# Altium schematic sheet LineCliffSensors.SchDoc
size A
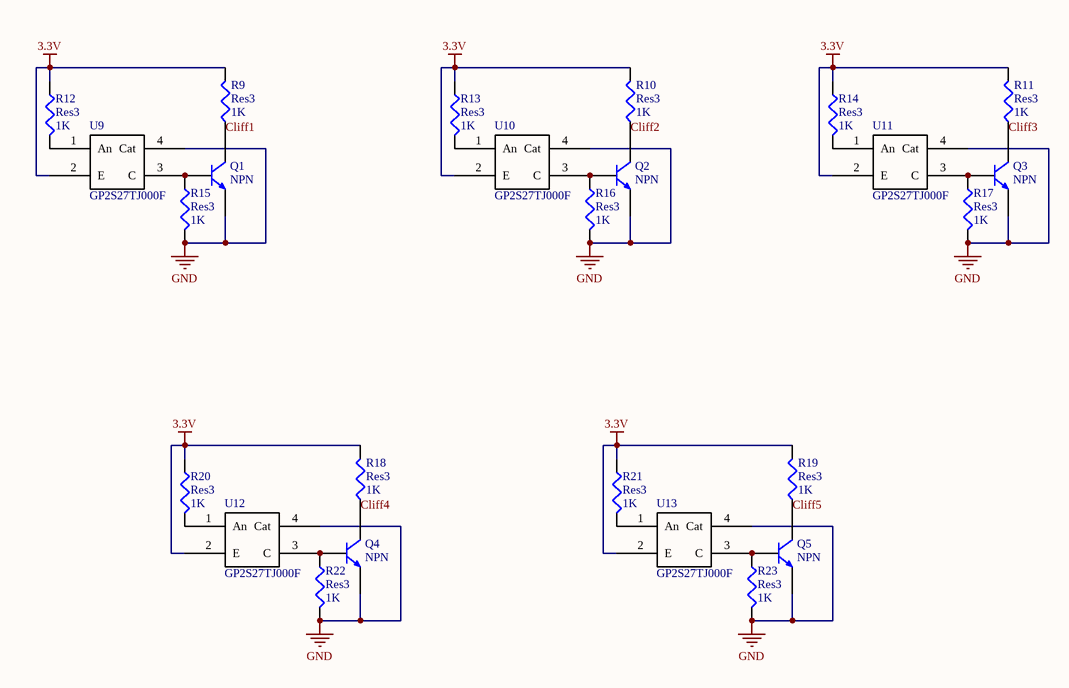
[diagram p0: LineCliffSensors.SchDoc]

## Parts
Q1  NPN  [SOT-23]
Q2  NPN  [SOT-23]
Q3  NPN  [SOT-23]
Q4  NPN  [SOT-23]
Q5  NPN  [SOT-23]
R9  Res3  value 1K  [RESC1608L]
R10  Res3  value 1K  [RESC1608L]
R11  Res3  value 1K  [RESC1608L]
R12  Res3  value 1K  [RESC1608L]
R13  Res3  value 1K  [RESC1608L]
R14  Res3  value 1K  [RESC1608L]
R15  Res3  value 1K  [RESC1608L]
R16  Res3  value 1K  [RESC1608L]
R17  Res3  value 1K  [RESC1608L]
R18  Res3  value 1K  [RESC1608L]
R19  Res3  value 1K  [RESC1608L]
R20  Res3  value 1K  [RESC1608L]
R21  Res3  value 1K  [RESC1608L]
R22  Res3  value 1K  [RESC1608L]
R23  Res3  value 1K  [RESC1608L]
U9  GP2S27TJ000F  [GP2S27J0000F]
U10  GP2S27TJ000F  [GP2S27J0000F]
U11  GP2S27TJ000F  [GP2S27J0000F]
U12  GP2S27TJ000F  [GP2S27J0000F]
U13  GP2S27TJ000F  [GP2S27J0000F]

## Nets
3.3V: R9.2 R10.2 R11.2 R12.1 R13.1 R14.1 R18.2 R19.2 R20.1 R21.1 U9.2(E) U10.2(E) U11.2(E) U12.2(E) U13.2(E)
GND: Q1.2(E) Q2.2(E) Q3.2(E) Q4.2(E) Q5.2(E) R15.2 R16.2 R17.2 R22.2 R23.2 U9.4(Cat) U10.4(Cat) U11.4(Cat) U12.4(Cat) U13.4(Cat)
Cliff1: Q1.3(C) R9.1
Cliff2: Q2.3(C) R10.1
Cliff3: Q3.3(C) R11.1
Cliff4: Q4.3(C) R18.1
Cliff5: Q5.3(C) R19.1
NetQ1_1: Q1.1(B) R15.1 U9.3(C)
NetQ2_1: Q2.1(B) R16.1 U10.3(C)
NetQ3_1: Q3.1(B) R17.1 U11.3(C)
NetQ4_1: Q4.1(B) R22.1 U12.3(C)
NetQ5_1: Q5.1(B) R23.1 U13.3(C)
NetR12_2: R12.2 U9.1(An)
NetR13_2: R13.2 U10.1(An)
NetR14_2: R14.2 U11.1(An)
NetR20_2: R20.2 U12.1(An)
NetR21_2: R21.2 U13.1(An)

## Library data of the parts
R9-R23 = Res3: Resistor; Published: 8-Jun-2000; LatestRevisionDate: 29-May-2009; LatestRevisionNote: IPC-7351 Footprint Added.; PackageReference: J1-0603; Publisher: Altium Limited; PackageDescription: Chip Resistor